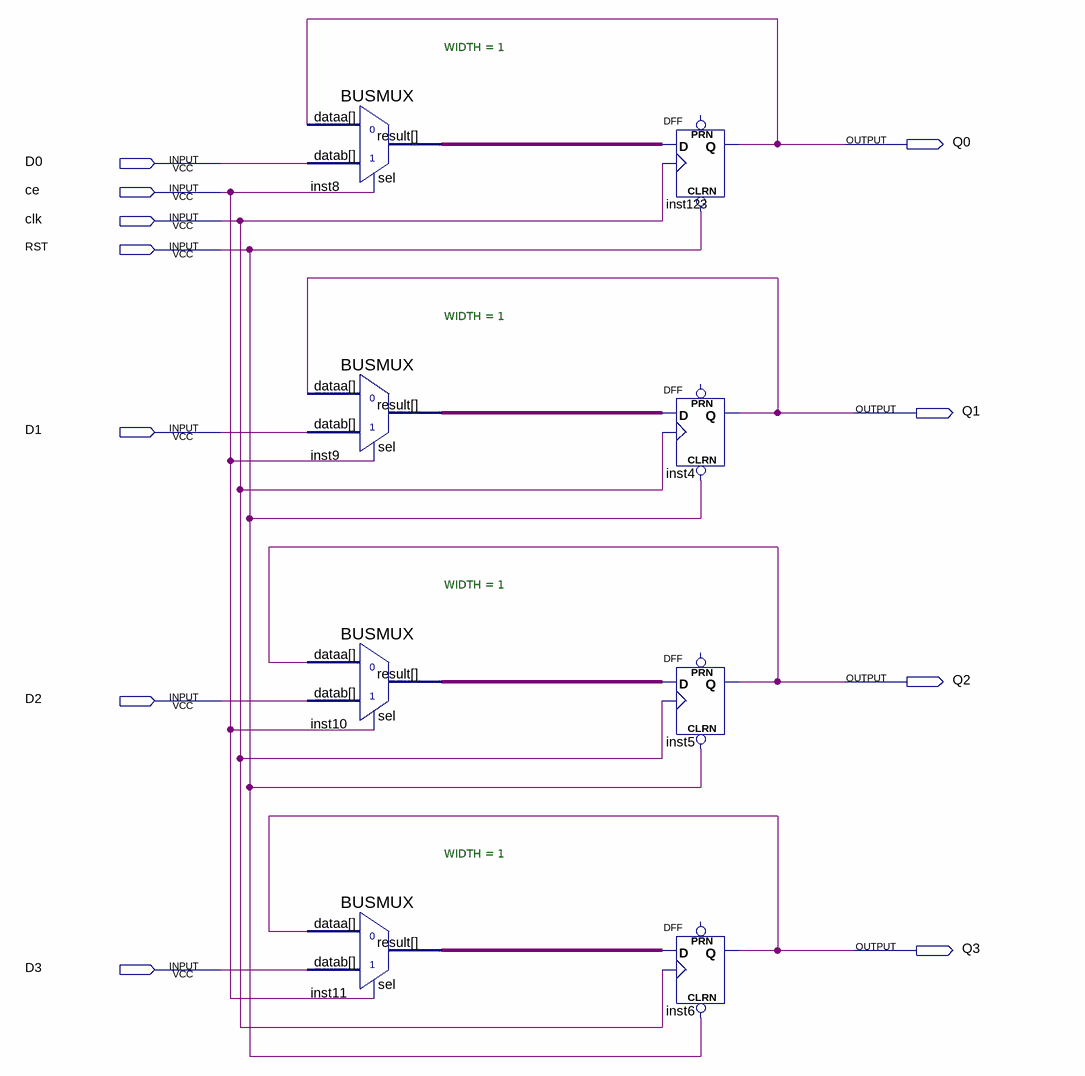
[diagram p0: schematic sheet]
// Quartus schematic work4.bdf as structural Verilog: 8 symbols, 11 pins
module work4 (
  input  D0,
  input  ce,
  input  clk,
  input  RST,
  input  D1,
  input  D2,
  input  D3,
  output Q0,
  output Q1,
  output Q2,
  output Q3
);

  wire inst8_result, inst9_result, inst10_result, inst11_result;

  BUSMUX #(.WIDTH(1)) inst8 (.datab(D0), .sel(ce), .dataa(Q0), .result(inst8_result));
  BUSMUX #(.WIDTH(1)) inst9 (.datab(D1), .sel(ce), .dataa(Q1), .result(inst9_result));
  BUSMUX #(.WIDTH(1)) inst10 (.datab(D2), .sel(ce), .dataa(Q2), .result(inst10_result));
  BUSMUX #(.WIDTH(1)) inst11 (.datab(D3), .sel(ce), .dataa(Q3), .result(inst11_result));
  DFF inst123 (.CLRN(RST), .CLK(clk), .D(inst8_result), .Q(Q0));  // open: PRN
  DFF inst4 (.CLRN(RST), .CLK(clk), .D(inst9_result), .Q(Q1));  // open: PRN
  DFF inst5 (.CLRN(RST), .CLK(clk), .D(inst10_result), .Q(Q2));  // open: PRN
  DFF inst6 (.CLRN(RST), .CLK(clk), .D(inst11_result), .Q(Q3));  // open: PRN
endmodule
